# EAGLE design ploza (EAGLE 8.0.2)
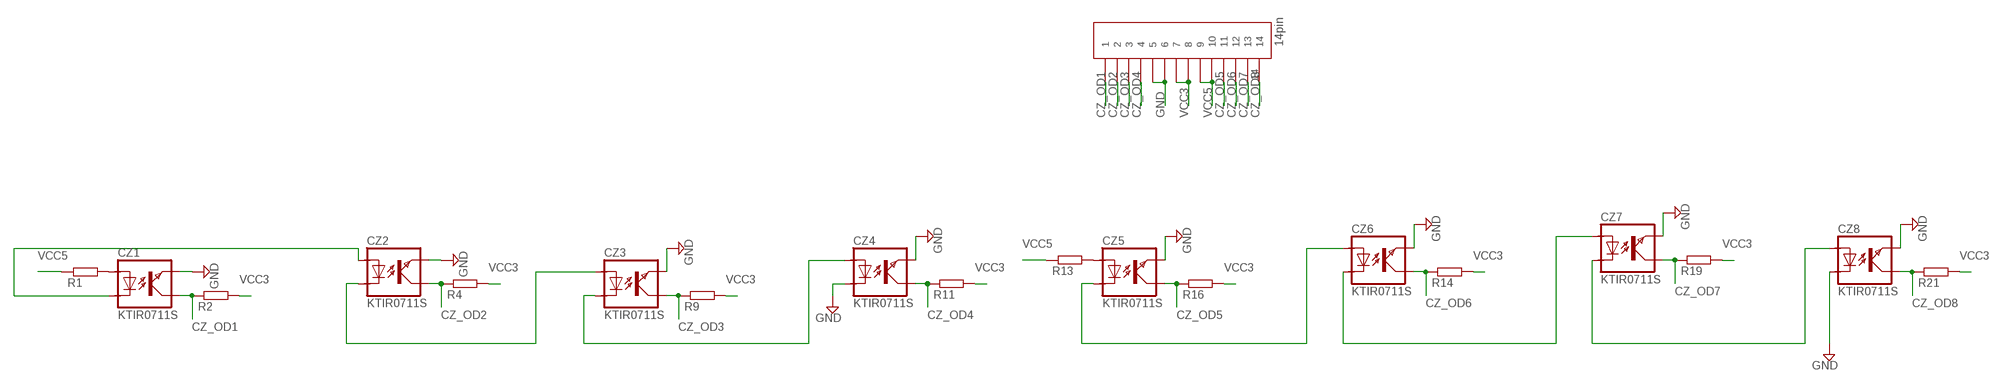
[diagram p0: schematic, sheet 1]

## Parts
CZ1  KTIR0711S  [TOP]
CZ2  KTIR0711S  [TOP]
CZ3  KTIR0711S  [TOP]
CZ4  KTIR0711S  [TOP]
CZ5  KTIR0711S  [TOP]
CZ6  KTIR0711S  [TOP]
CZ7  KTIR0711S  [TOP]
CZ8  KTIR0711S  [TOP]
R1  R-EU_R0805  [R0805]
R2  R-EU_R0805  [R0805]
R4  R-EU_R0805  [R0805]
R9  R-EU_R0805  [R0805]
R11  R-EU_R0805  [R0805]
R13  R-EU_R0805  [R0805]
R14  R-EU_R0805  [R0805]
R16  R-EU_R0805  [R0805]
R19  R-EU_R0805  [R0805]
R21  R-EU_R0805  [R0805]
U$2  14PIN  [14PIN]

## Nets
CZ_OD1: CZ1.KOLEKTOR R2.1 U$2.1
CZ_OD2: CZ2.KOLEKTOR R4.1 U$2.2
CZ_OD3: CZ3.KOLEKTOR R9.1 U$2.3
CZ_OD4: CZ4.KOLEKTOR R11.1 U$2.4
CZ_OD5: CZ5.KOLEKTOR R16.1 U$2.11
CZ_OD6: CZ6.KOLEKTOR R14.1 U$2.12
CZ_OD7: CZ7.KOLEKTOR R19.1 U$2.13
CZ_OD8: CZ8.KOLEKTOR R21.1 U$2.14
GND [zasilanie]: CZ1.EMITER CZ2.EMITER CZ3.EMITER CZ4.EMITER CZ4.KATODA CZ5.EMITER CZ6.EMITER CZ7.EMITER CZ8.EMITER CZ8.KATODA U$2.5 U$2.6
N$1 [zasilanie]: CZ5.KATODA CZ6.ANODA
N$2: CZ1.ANODA R1.2
N$3 [zasilanie]: CZ1.KATODA CZ2.ANODA
N$4 [zasilanie]: CZ2.KATODA CZ3.ANODA
N$5 [zasilanie]: CZ3.KATODA CZ4.ANODA
N$6: CZ5.ANODA R13.2
N$7 [zasilanie]: CZ6.KATODA CZ7.ANODA
N$8 [zasilanie]: CZ7.KATODA CZ8.ANODA
VCC3 [zasilanie]: R2.2 R4.2 R9.2 R11.2 R14.2 R16.2 R19.2 R21.2 U$2.7 U$2.8
VCC5 [zasilanie]: R1.1 R13.1 U$2.9 U$2.10

## Library data of the parts
CZ1-CZ8 = KTIR0711S:KTIR0711S
R1 R2 R4 R9 R11 R13 R14 R16 R19 R21 = rcl:R-EU_: RESISTOR, European symbol
U$2 = ffc_fcp(1):14PIN

## Net classes
0 default: width 0.305 mm
1 zasilanie: width 0.406 mm

## Board
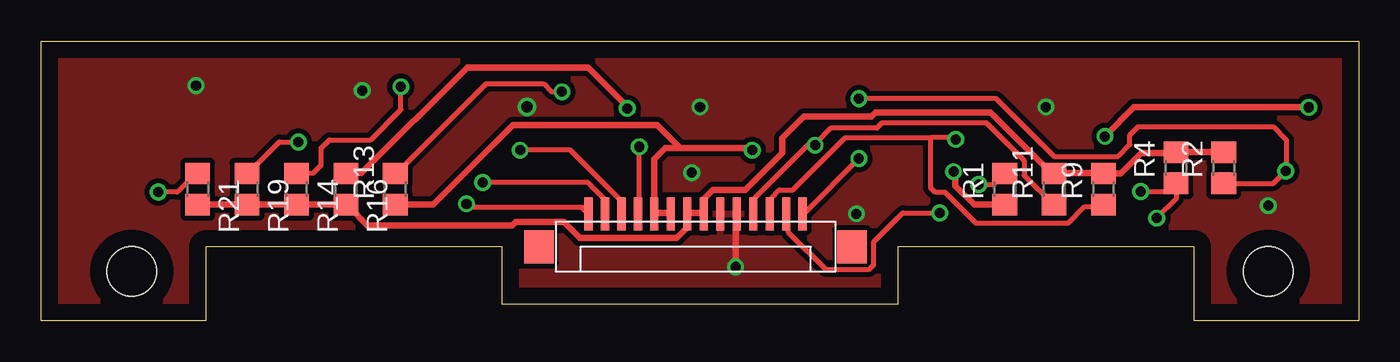
[diagram p1: board, top side]
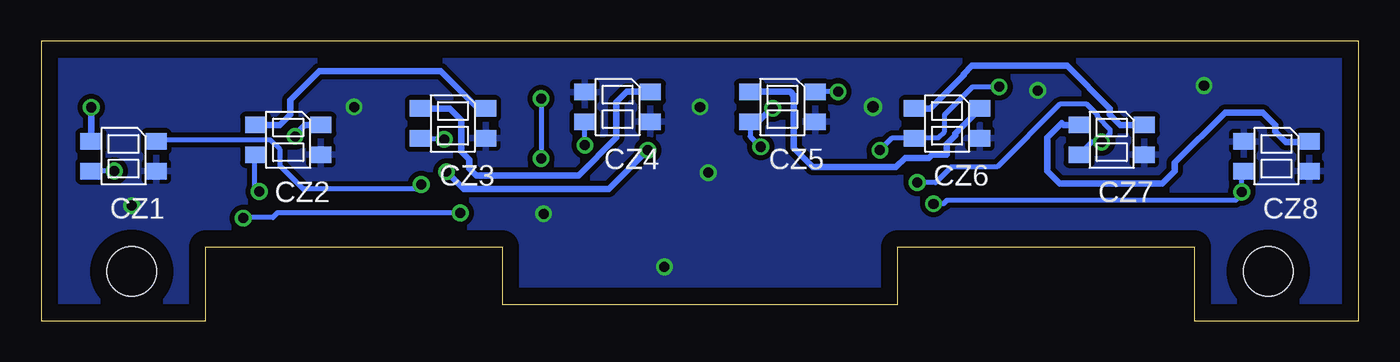
[diagram p2: board, bottom side, seen from below]

Size 80 x 17 mm. Coordinates in mm from the lower left corner, seen from the top.
Outline: 0,17 80,17 80,0 70,0 70,4.5 52,4.5 52,1 28,1 28,4.5 10,4.5 10,0 0,0 0,17
Copper layers (1*16): Top 0.035mm / dielectric 1.5mm / Bottom 0.035mm
Design rules "default": minimum track width 10mil, minimum drill 24mil, track to track 8mil, track to pad 8mil, pad to pad 8mil, via to via 8mil, smd to smd 8mil, copper to edge 40mil, drill to drill 8mil, minimum pad ring 10mil, minimum via ring 8mil, stop-mask expansion 4mil, vias tented up to drill 0mil, thermal gap 10mil
Holes 3 mm at 74.5,3 5.5,3

### Footprints (pad centres in the part's own frame; a part is rotated, then mirrored left to right if it is on the bottom)
TOP = smd 1.27 x 1: ANODA -1.985,-0.9; EMITER -1.985,0.9; KATODA 1.985,-0.9; KOLEKTOR 1.985,0.91
R0805 = smd 1.3 x 1.5: 1 -0.95,0; 2 0.95,0
14PIN = smd 2 x 0.5: 1 -1.5,6.23; 2 -1.5,5.23; 3 -1.5,4.23; 4 -1.5,3.23; 5 -1.5,2.23; 6 -1.5,1.23; 7 -1.5,0.23; 8 -1.5,-0.77; 9 -1.5,-1.77; 10 -1.5,-2.77; 11 -1.5,-3.77; 12 -1.5,-4.77; 13 -1.5,-5.77; 14 -1.5,-6.77 | smd 2 x 1.8: 19 0.5,9.23; 20 0.5,-9.77

### Placement (x,y rotation side)
CZ1  75,10 180 bottom
CZ2  65,11 180 bottom
CZ3  55,12 180 bottom
CZ4  45,13 180 bottom
CZ5  35,13 180 bottom
CZ6  25,12 180 bottom
CZ7  15,11 180 bottom
CZ8  5,10 180 bottom
R1  58.5,8 90 top
R2  71.8,9.3 90 top
R4  68.9,9.3 90 top
R9  64.5,8 90 top
R11  61.5,8 90 top
R13  21.5,8 90 top
R14  15.5,8 270 top
R16  18.5,8 270 top
R19  12.5,8 270 top
R21  9.5,8 270 top
U$2  40,5 270 top

### Tracks (layer width: path | path; a pad name or v marks a point on that pad's centre or on a via)
CZ_OD1  (via drill 0.61)
  Top 0.305: v49.65,9.86 46.35,6.56 U$2.1 | v49.65,13.51 v49.66,13.5 58,13.5 61.52,9.98 65.39,9.98 66.1,10.7 66.1,11.3 66.6,11.8 74.8,11.8 75.6,11 75.6,9.14 v75.56,9.1 74.81,8.35 R2.1
  Bottom 0.305: v75.56,9.1 76.96,9.1 CZ1.KOLEKTOR | v49.65,13.51 v49.65,9.86
CZ_OD2  (via drill 0.61)
  Top 0.305: U$2.2 45.33,6.43 45.33,5.41 47.62,3.13 50.29,3.13 50.54,3.38 50.54,4.78 52.32,6.56 v54.56,6.56 | v67.73,6.24 68.9,7.4 R4.1 68.4,7.85 v66.76,7.85
  Bottom 0.305: CZ2.KOLEKTOR 67.05,9.98 67.05,8.15 v66.76,7.85 | v54.56,6.56 65.65,6.56 65.94,6.28 67.7,6.28 v67.73,6.24
CZ_OD3  (via drill 0.61)
  Top 0.305: U$2.3 44.32,6.56 44.32,7.45 44.83,7.95 45.63,7.95 48.81,11.13 54.01,11.13 | 54.01,11.13 54.01,8.08 54.28,7.8 54.88,7.8 56.76,5.92 62.35,5.92 63.37,6.94 64.38,6.94 R9.1 | v55.52,11.03 55.42,11.13 54.01,11.13
  Bottom 0.305: 56.89,11.13 CZ3.KOLEKTOR 55.58,11.09 arc90 v55.52,11.03
CZ_OD4  (via drill 0.61)
  Top 0.305: U$2.4 43.3,6.56 43.3,7.45 46.73,10.87 46.78,10.87 v46.98,10.67 47.11,10.8 47.11,10.87 47.94,11.7 50.73,11.7 51.05,12.02 57.4,12.02 59.69,9.73 59.69,8.84 61.46,7.06 R11.1
  Bottom 0.305: v46.98,10.67 CZ4.KOLEKTOR
CZ_OD5  (via drill 0.61)
  Top 0.305: 36.32,6.56 v36.32,10.57
  Top 0.406: U$2.11 36.32,6.56 | R16.1 18.54,8.97 19.43,8.97 25.86,15.4 33.2,15.4 35.58,13.02 v35.58,12.91
  Bottom 0.305: v36.32,10.57 36.95,11.21 36.95,12.02
  Bottom 0.406: 36.95,12.02 CZ5.KOLEKTOR 36.83,12.14 36.44,12.14 35.68,12.91 v35.58,12.91
CZ_OD6  (via drill 0.61)
  Top 0.305: v29.08,10.37 32.13,10.37 35.17,7.32 35.17,6.56 U$2.12 | R14.1 15.62,8.97 16.5,8.97 17,9.46 17,10.5 17.5,11 20,11 21.84,12.84 v21.84,14.22
  Bottom 0.305: v29.08,10.37 28.32,11.13 27.05,11.13 CZ6.KOLEKTOR 26.92,11.13 25.52,11.13 25.14,11.51 25.14,12.53 23.44,14.22 v21.84,14.22
CZ_OD7  (via drill 0.61)
  Top 0.305: R19.1 12.57,8.97 14.46,10.87 v15.62,10.87 | U$2.13 34.16,6.56 34.16,7.45 33.65,7.95 33.2,8.4 v26.81,8.4
  Bottom 0.305: 16.89,10.11 CZ7.KOLEKTOR 16.21,10.87 v15.62,10.87 15.11,11.37 15.11,11.64 15.87,12.4 15.87,12.53 16.51,13.17 18.15,13.17 21.97,9.35 24.76,9.35 24.76,9.34 25.7,8.4 v26.81,8.4
CZ_OD8  (via drill 0.61)
  Top 0.305: v7.11,7.83 8.25,7.83 9.39,8.97 R21.1 | 33.14,6.56 U$2.14 32.83,6.9 26.03,6.9 v25.82,7.11
  Bottom 0.305: CZ8.KOLEKTOR 7.11,8.97 v7.11,7.83 7.11,7.7 7.49,7.32 25.01,7.32 25.22,7.11 v25.82,7.11
GND  (via drill 0.61, 0.7)
  Top 0.406: v42.16,3.28 42.16,6.3 U$2.5
  other vias: 40,13 19.5,14 29.5,13 39.5,9 61,13 74.5,7 49.5,6.5 9.4,14.3
  pour Bottom (isolate 0.305): 0,17 80,17 80,0 70,0 70,4.5 52,4.5 52,1 28,1 28,4.5 10,4.5 10,0 0,0
  pour Top (isolate 0.305): 0,17 80,17 80,0 70,0 70,4.5 52,4.5 52,1 28,1 28,4.5 10,4.5 10,0 0,0
N$1
  Bottom 0.406: CZ6.ANODA 23.11,12.78 24.51,11.38 24.51,11.26 25.01,10.75 25.01,10.11 25.89,10.11 26.1,9.9 27.55,9.9 28.1,9.35 33.14,9.35 34.3,10.51 34.3,13.7 34.52,13.92 36.95,13.92 CZ5.KATODA
N$2  (via drill 0.61)
  Top 0.305: R1.2 57.83,8.28 v56.92,8.28
  Bottom 0.305: 57.3,8.1 57.2,8.1 57.02,8.28 v56.92,8.28 57.2,8 64.1,8 65.5,9.4 65.5,10.4 66.1,11 72.91,11 CZ1.ANODA 72.89,10.87
N$3  (via drill 0.61)
  Top 0.406: v76.96,12.97 66.35,12.97 v64.58,11.21
  Bottom 0.406: 76.96,10.87 CZ1.KATODA 76.96,10.93 v76.96,12.97 | CZ2.ANODA 63.11,11.89 64,11.89 64.58,11.31 v64.58,11.21
N$4
  Bottom 0.406: CZ2.KATODA 66.92,11.89 65.53,11.89 64.89,12.53 64.89,13.41 63.11,15.18 55.75,15.18 53.46,12.9 CZ3.ANODA 53.08,12.91
N$5
  Bottom 0.406: CZ4.ANODA 43.05,13.92 44.45,13.92 45.08,13.29 45.08,11.13 47.37,8.84 53.59,8.84 54,9.25 54,9.8 54.5,10.3 54.5,12.2 55.21,12.91 56.89,12.91 CZ3.KATODA
N$6  (via drill 0.61)
  Top 0.305: R13.2 21.59,8.97 27.02,14.4 30.5,14.4 30.98,13.92 v31.62,13.92
  Bottom 0.305: v31.62,13.92 33.02,13.92 CZ5.ANODA
N$7
  Bottom 0.406: CZ7.ANODA 13.08,11.89 14.47,11.89 15.11,12.53 15.11,12.91 17.7,15.5 23.5,15.5 24,15 24,14.94 26.03,12.91 26.92,12.91 CZ6.KATODA
N$8
  Bottom 0.406: CZ8.ANODA 3.04,10.87 4.44,10.87 5.08,11.51 5.08,11.89 5.84,12.65 8.12,12.65 11.17,9.6 11.17,9.1 11.93,8.33 18.16,8.33 18.92,9.1 18.92,11.13 18.03,12.02 17.9,11.89 17.01,11.89 CZ7.KATODA
VCC3
  Top 0.406: R9.2 64.38,8.97 61.59,8.97 R11.2 61.34,8.97 57.65,12.65 50.65,12.65 50.4,12.4 46.3,12.4 45,11.1 45,10.2 42.75,7.95 40.76,7.95 40.25,7.45 40.25,6.68 U$2.7 40.13,6.56 39.24,6.56 U$2.8 39.24,6.3 39.24,5.67 38.6,5.03 32.7,5.03 31.73,6 28.8,6 28.6,5.8 19.81,5.8 19.81,5.79 | 64.64,8.97 R9.2 | R21.2 9.52,7.06 12.44,7.06 R19.2 12.7,7.06 15.49,7.06 R14.2 15.62,7.06 18.41,7.06 R16.2 18.66,6.94 19.81,5.79 | 19.81,5.79 | R9.2 65.55,8.95 66.8,10.2 68.85,10.2 R4.2 R2.2
VCC5  (via drill 0.61)
  Top 0.406: R13.1 21.59,7.06 23.8,7.06 28.63,11.89 37.41,11.89 38.8,10.5 | 37.33,6.56 U$2.10 | R1.1 58.41,7.06 56.64,7.06 55.49,8.21 55.49,8.96 v55.39,9.06 | U$2.9 38.22,6.56 37.46,6.56 U$2.10 | U$2.10 37.23,9.83 37.9,10.5 38.8,10.5 | 38.8,10.5 43.04,10.5 v43.17,10.37
  Bottom 0.406: v55.39,9.06 54.33,8 45.54,8 v43.17,10.37